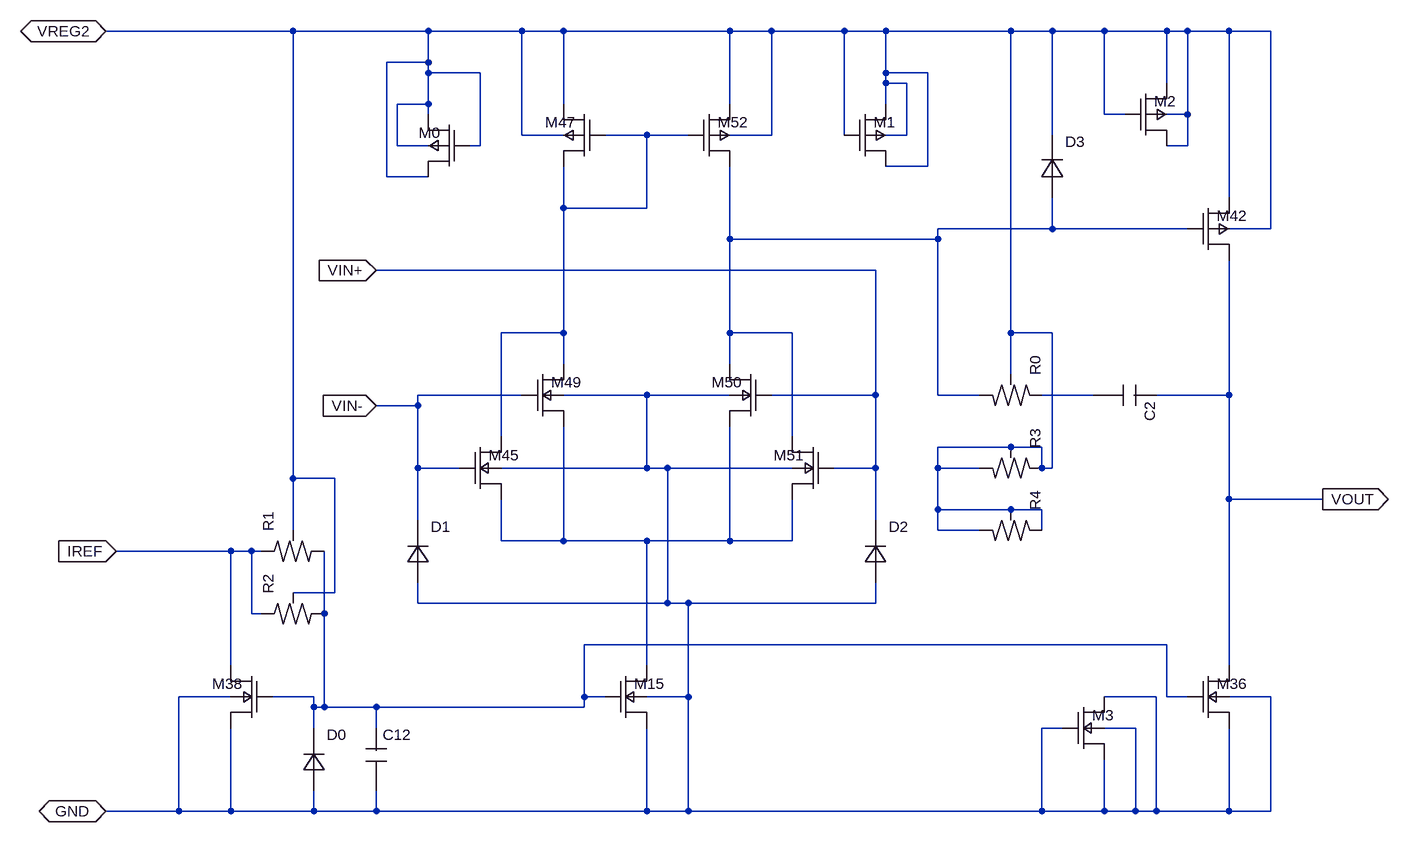
[diagram p0: schematic AMP_01_00.asc]
AMP_01_00.asc, the LTspice schematic file:
Version 4
SHEET 1 7088 2000
WIRE 3040 608 3120 608
WIRE 3136 48 3232 48
WIRE 2880 720 2944 720
WIRE 2992 512 3056 512
WIRE 1952 912 1952 736
WIRE 2880 688 2992 688
WIRE 3056 720 3056 512
WIRE 2560 48 2624 48
WIRE 2176 224 2176 112
WIRE 3328 304 3328 48
WIRE 1888 736 1952 736
WIRE 3040 720 3040 688
WIRE 2880 816 2880 784
WIRE 3040 816 3040 784
WIRE 2880 784 2992 784
WIRE 1888 736 1888 48
WIRE 2736 48 2800 48
WIRE 2880 784 2880 720
WIRE 2992 512 2992 48
WIRE 1888 912 1952 912
WIRE 2992 48 3056 48
WIRE 2048 160 2096 160
WIRE 2096 96 2096 48
WIRE 2880 720 2880 688
WIRE 3136 176 3168 176
WIRE 2800 256 2864 256
WIRE 2304 48 2560 48
WIRE 2880 816 2944 816
WIRE 3232 48 3264 48
WIRE 2032 272 2096 272
WIRE 3232 128 3232 48
WIRE 1888 48 2096 48
WIRE 3328 352 3392 352
WIRE 3136 176 3136 48
WIRE 3040 720 3056 720
WIRE 2800 160 2800 128
WIRE 2304 160 2304 48
WIRE 3392 352 3392 48
WIRE 2032 96 2096 96
WIRE 3264 48 3328 48
WIRE 2800 48 2992 48
WIRE 2048 224 2096 224
WIRE 2624 48 2736 48
WIRE 2096 112 2176 112
WIRE 2096 112 2096 96
WIRE 2160 224 2176 224
WIRE 3264 224 3264 176
WIRE 2800 112 2864 112
WIRE 2864 256 2864 112
WIRE 2800 112 2800 48
WIRE 2032 272 2032 96
WIRE 2624 208 2624 48
WIRE 3264 176 3264 48
WIRE 3232 176 3264 176
WIRE 2096 160 2096 112
WIRE 2800 208 2832 208
WIRE 2096 176 2096 160
WIRE 2048 224 2048 160
WIRE 2992 576 2992 512
WIRE 2832 208 2832 128
WIRE 2800 128 2832 128
WIRE 1600 48 1888 48
WIRE 1888 816 1888 736
WIRE 3056 208 3056 48
WIRE 2096 48 2240 48
WIRE 3056 48 3136 48
WIRE 3232 224 3264 224
WIRE 2240 208 2240 48
WIRE 2240 48 2304 48
WIRE 2240 208 2304 208
WIRE 2560 160 2560 48
WIRE 2560 208 2624 208
WIRE 3328 48 3392 48
WIRE 2800 128 2800 112
WIRE 2736 208 2736 48
WIRE 2992 688 3040 688
WIRE 2992 784 3040 784
WIRE 3328 768 3328 608
WIRE 3216 608 3328 608
WIRE 3328 608 3328 400
WIRE 3328 1024 3328 768
WIRE 3328 768 3472 768
WIRE 2080 720 2080 624
WIRE 2080 608 2240 608
WIRE 2080 624 2080 608
WIRE 2016 624 2080 624
WIRE 2080 720 2144 720
WIRE 2080 800 2080 720
WIRE 3232 1072 3232 992
WIRE 1920 1088 1920 1072
WIRE 2336 1088 2336 1072
WIRE 3232 1072 3264 1072
WIRE 2336 1072 2336 992
WIRE 2016 1088 2336 1088
WIRE 1856 1072 1920 1072
WIRE 2336 992 3232 992
WIRE 1920 1088 1936 1088
WIRE 1920 1120 1920 1088
WIRE 2336 1072 2368 1072
WIRE 1936 1088 2016 1088
WIRE 2016 1120 2016 1088
WIRE 1936 1088 1936 944
WIRE 1936 944 1936 848
WIRE 2656 672 2656 512
WIRE 2880 608 2880 368
WIRE 2880 368 2880 352
WIRE 2560 368 2880 368
WIRE 2560 512 2560 368
WIRE 2560 512 2656 512
WIRE 2880 352 3056 352
WIRE 2560 368 2560 256
WIRE 2560 560 2560 512
WIRE 3056 352 3056 304
WIRE 3056 352 3264 352
WIRE 2880 608 2944 608
WIRE 2432 320 2432 208
WIRE 2304 512 2304 320
WIRE 2304 320 2304 256
WIRE 2304 320 2432 320
WIRE 2208 512 2304 512
WIRE 2304 560 2304 512
WIRE 2208 672 2208 512
WIRE 2368 208 2432 208
WIRE 2432 208 2496 208
WIRE 1824 848 1840 848
WIRE 1824 944 1824 848
WIRE 1616 848 1792 848
WIRE 1792 1024 1792 848
WIRE 1824 944 1840 944
WIRE 1792 848 1824 848
WIRE 2304 832 2432 832
WIRE 2432 1024 2432 832
WIRE 2560 832 2560 656
WIRE 2560 832 2656 832
WIRE 2656 832 2656 768
WIRE 2208 832 2208 768
WIRE 2208 832 2304 832
WIRE 2304 832 2304 656
WIRE 2432 832 2560 832
WIRE 3328 1248 3328 1120
WIRE 1920 1248 2016 1248
WIRE 2432 1248 2432 1120
WIRE 3184 1248 3184 1120
WIRE 3136 1120 3184 1120
WIRE 3184 1248 3216 1248
WIRE 3136 1248 3136 1168
WIRE 3136 1072 3216 1072
WIRE 2464 928 2496 928
WIRE 3136 1248 3184 1248
WIRE 3392 1248 3392 1072
WIRE 2496 1072 2496 928
WIRE 2080 928 2080 896
WIRE 2080 928 2464 928
WIRE 2432 1248 2496 1248
WIRE 2496 1248 2496 1072
WIRE 3216 1248 3328 1248
WIRE 2432 608 2560 608
WIRE 2496 1248 3040 1248
WIRE 2496 1072 2432 1072
WIRE 2016 1248 2432 1248
WIRE 1792 1248 1920 1248
WIRE 3040 1248 3136 1248
WIRE 3040 1248 3040 1120
WIRE 2304 608 2432 608
WIRE 3216 1248 3216 1072
WIRE 2496 928 2784 928
WIRE 2208 720 2432 720
WIRE 3040 1120 3072 1120
WIRE 1712 1248 1792 1248
WIRE 2432 720 2464 720
WIRE 1600 1248 1712 1248
WIRE 2432 720 2432 608
WIRE 2464 928 2464 720
WIRE 1712 1248 1712 1072
WIRE 3328 1072 3392 1072
WIRE 3328 1248 3392 1248
WIRE 2016 1248 2016 1216
WIRE 1792 1248 1792 1120
WIRE 1920 1248 1920 1216
WIRE 2784 928 2784 896
WIRE 1712 1072 1792 1072
WIRE 2464 720 2656 720
WIRE 2784 800 2784 720
WIRE 2784 608 2784 416
WIRE 2784 720 2784 608
WIRE 2016 416 2784 416
WIRE 2624 608 2784 608
WIRE 2720 720 2784 720
FLAG 1600 1248 GND
IOPIN 1600 1248 inout
FLAG 1600 48 VREG2
IOPIN 1600 48 inout
FLAG 2016 624 VIN-
IOPIN 2016 624 in
FLAG 1616 848 IREF
IOPIN 1616 848 in
FLAG 3472 768 VOUT
IOPIN 3472 768 out
FLAG 2016 416 VIN+
IOPIN 2016 416 in
SYMBOL MP 2736 208 R0
SYMATTR InstName M1
SYMATTR Value2 w=40u l=5u
SYMBOL MN 3072 1120 R0
SYMATTR InstName M3
SYMATTR Value2 l=5u m=8 w=8u
SYMBOL MP 2496 208 R0
SYMATTR InstName M52
SYMATTR Value2 m=2 w=40u l=5u
SYMBOL MP 2160 224 M0
SYMATTR InstName M0
SYMATTR Value2 l=5u w=40u
SYMBOL MP 3168 176 R0
SYMATTR InstName M2
SYMATTR Value2 w=40u l=1u m=4
SYMBOL MN 2624 608 M0
SYMATTR InstName M50
SYMATTR Value2 m=2 l=8u w=40u
SYMBOL RR_W2.8 3040 816 M270
SYMATTR InstName R4
SYMATTR Value 6.34358K
SYMBOL MN 3264 1072 R0
SYMATTR InstName M36
SYMATTR Value2 l=5u w=8u m=10
SYMBOL DP 3056 208 R0
SYMATTR InstName D3
SYMBOL MN 2720 720 M0
SYMATTR InstName M51
SYMATTR Value2 l=8u m=2 w=40u
SYMBOL MP 3264 352 R0
SYMATTR InstName M42
SYMATTR Value2 w=40u m=2 l=1u
SYMBOL MP 2368 208 M0
SYMATTR InstName M47
SYMATTR Value2 l=5u w=40u m=2
SYMBOL CSIO 2016 1120 R0
SYMATTR InstName C12
SYMATTR Value 1p
SYMBOL RR_W2.8 1840 944 R270
SYMATTR InstName R2
SYMATTR Value 4.326946K
SYMBOL RR_W2.8 3040 608 M270
SYMATTR InstName R0
SYMATTR Value 6.34358K
SYMBOL MN 2144 720 R0
SYMATTR InstName M45
SYMATTR Value2 w=40u m=2 l=8u
SYMBOL DN 1920 1120 R0
SYMATTR InstName D0
SYMBOL DN 2080 800 R0
SYMATTR InstName D1
SYMBOL MN 2240 608 R0
SYMATTR InstName M49
SYMATTR Value2 l=8u m=2 w=40u
SYMBOL CSIO 3216 608 R90
SYMATTR InstName C2
SYMATTR Value 2p
SYMBOL MN 1856 1072 M0
SYMATTR InstName M38
SYMATTR Value2 w=8u l=5u m=2
SYMBOL MN 2368 1072 R0
SYMATTR InstName M15
SYMATTR Value2 w=8u l=5u m=4
SYMBOL DN 2784 800 R0
SYMATTR InstName D2
SYMBOL RR_W2.8 1840 848 R270
SYMATTR InstName R1
SYMATTR Value 4.326946K
SYMBOL RR_W2.8 3040 720 M270
SYMATTR InstName R3
SYMATTR Value 6.34358K

The netlist it stands for:
* AMP_01_00.asc
M1 VREG2 VREG2 VREG2 VREG2 MP w=40u l=5u
M3 GND GND GND GND MN l=5u m=8 w=8u
M52 VREG2 N004 N003 VREG2 MP m=2 w=40u l=5u
M0 VREG2 VREG2 VREG2 VREG2 MP l=5u w=40u
M2 VREG2 VREG2 VREG2 VREG2 MP w=40u l=1u m=4
M50 N005 VIN+ N003 GND MN m=2 l=8u w=40u
R4 VREG2 VREG2 VREG2 6.34358K
M36 GND N002 VOUT GND MN l=5u w=8u m=10
D3 N003 VREG2 DP
M51 N005 VIN+ N003 GND MN l=8u m=2 w=40u
M42 VREG2 N003 VOUT VREG2 MP w=40u m=2 l=1u
M47 VREG2 N004 N004 VREG2 MP l=5u w=40u m=2
C12 N002 GND 1p
R2 VREG2 IREF N002 4.326946K
R0 VREG2 N001 N003 6.34358K
M45 N005 VIN- N004 GND MN w=40u m=2 l=8u
D0 N002 GND DN
D1 VIN- GND DN
M49 N005 VIN- N004 GND MN l=8u m=2 w=40u
C2 VOUT N001 2p
M38 GND N002 IREF GND MN w=8u l=5u m=2
M15 GND N002 N005 GND MN w=8u l=5u m=4
D2 VIN+ GND DN
R1 VREG2 IREF N002 4.326946K
R3 VREG2 VREG2 VREG2 6.34358K
.model D D
.lib standard.dio
.model NMOS NMOS
.model PMOS PMOS
.lib standard.mos
.backanno
.end